# EAGLE design power_board (EAGLE 9.6.2)
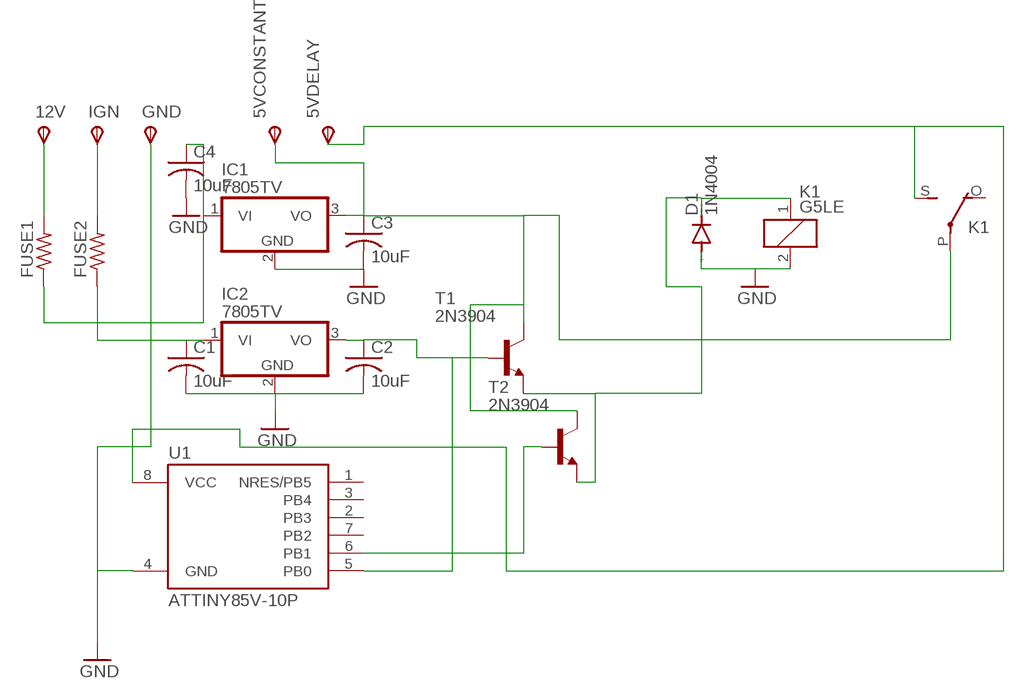
[diagram p0: schematic, sheet 1]

## Parts
5VCONSTANT  TPSPAD1-13Y  [P1-13Y]
5VDELAY  TPSPAD1-13Y  [P1-13Y]
12V  TPSPAD1-13Y  [P1-13Y]
C1  10uF  C-USC0603  [C0603]
C2  10uF  C-USC0603  [C0603]
C3  10uF  C-USC0603  [C0603]
C4  10uF  C-USC0603  [C0603]
D1  1N4004  [DO41-10]
FUSE1  R-US_R0805  [R0805]
FUSE2  R-US_R0805  [R0805]
GND  TPSPAD1-13Y  [P1-13Y]
IC1  7805TV  [TO220V]
IC2  7805TV  [TO220V]
IGN  TPSPAD1-13Y  [P1-13Y]
K1  G5LE  [G5LE]
T1  2N3904  [TO92]
T2  2N3904  [TO92]
U1  ATTINY85V-10P  [PDIP08_300MIL]

## Nets
GND: C1.2 C2.2 C3.2 C4.2 D1.A GND.TP(PP) IC1.2(GND) IC2.2(GND) K1.2 U1.4(GND)
N$1: 12V.TP(PP) FUSE1.2
N$2: FUSE2.2 IGN.TP(PP)
N$3: C1.1 FUSE2.1 IC2.1(VI)
N$4: C4.1 FUSE1.1 IC1.1(VI)
N$5: C2.1 IC2.3(VO) T1.2(B) U1.5(PB0)
N$6: 5VCONSTANT.TP(PP) C3.1 IC1.3(VO) K1.P(2:P) T1.1(C) T2.1(C)
N$7: D1.C K1.1 T1.3(E) T2.3(E)
N$8: 5VDELAY.TP(PP) K1.S(2:S) U1.8(VCC)
N$10: T2.2(B) U1.6(PB1)
Unconnected: K1.O(2:O) U1.1(NRES/PB5) U1.2(PB3) U1.3(PB4) U1.7(PB2)

## Library data of the parts
5VCONSTANT 5VDELAY 12V GND IGN = testpad:TPS: TEST PIN
C1-C4 = rcl:C-US: CAPACITOR, American symbol; SPICEPREFIX: C
D1 = diode:1N4004: DIODE general purpose rectifier, 1 A
FUSE1 FUSE2 = rcl:R-US_: RESISTOR, American symbol; SPICEPREFIX: R
IC1 IC2 = linear:78*: Positive VOLTAGE REGULATOR Source: http://cache.national.com/ds/LM/LM78L05.pdf http://www.fairchildsemi.com/ds/LM/LM7805.pdf
K1 = relay:G5LE: RELAY 1 x switch, 10 A/120 V AC, 8 A/30 V DC, Omron; OC_FARNELL: unknown; OC_NEWARK: unknown
T1 T2 = transistor:2N3904: NPN TRANSISTOR
U1 = _hhn_attiny25_45_85:ATTINY85*: ATMEL ATtiny 85 Packages: P = PDIP 08 30mil S = SOIC 08 EIAJ 208mil Technologies Note: for complete ordering code (temp. range, finish, tape&reel etc.) see www.atmel.com • Supply Voltage: V = (1.8…5.5)V | [blank] = (2.7…5.5)V • Speed: 10 = 10 MHz | 20 = 20 MHz Author: Dipl.-Ing. FH Rainer Bayer HHN Hochschule Heilbronn (Heilbronn University), rainer.bayer@hs-heilbronn.de Ingenieurbüro ing-rb, mail@ing-rb.de

## Board
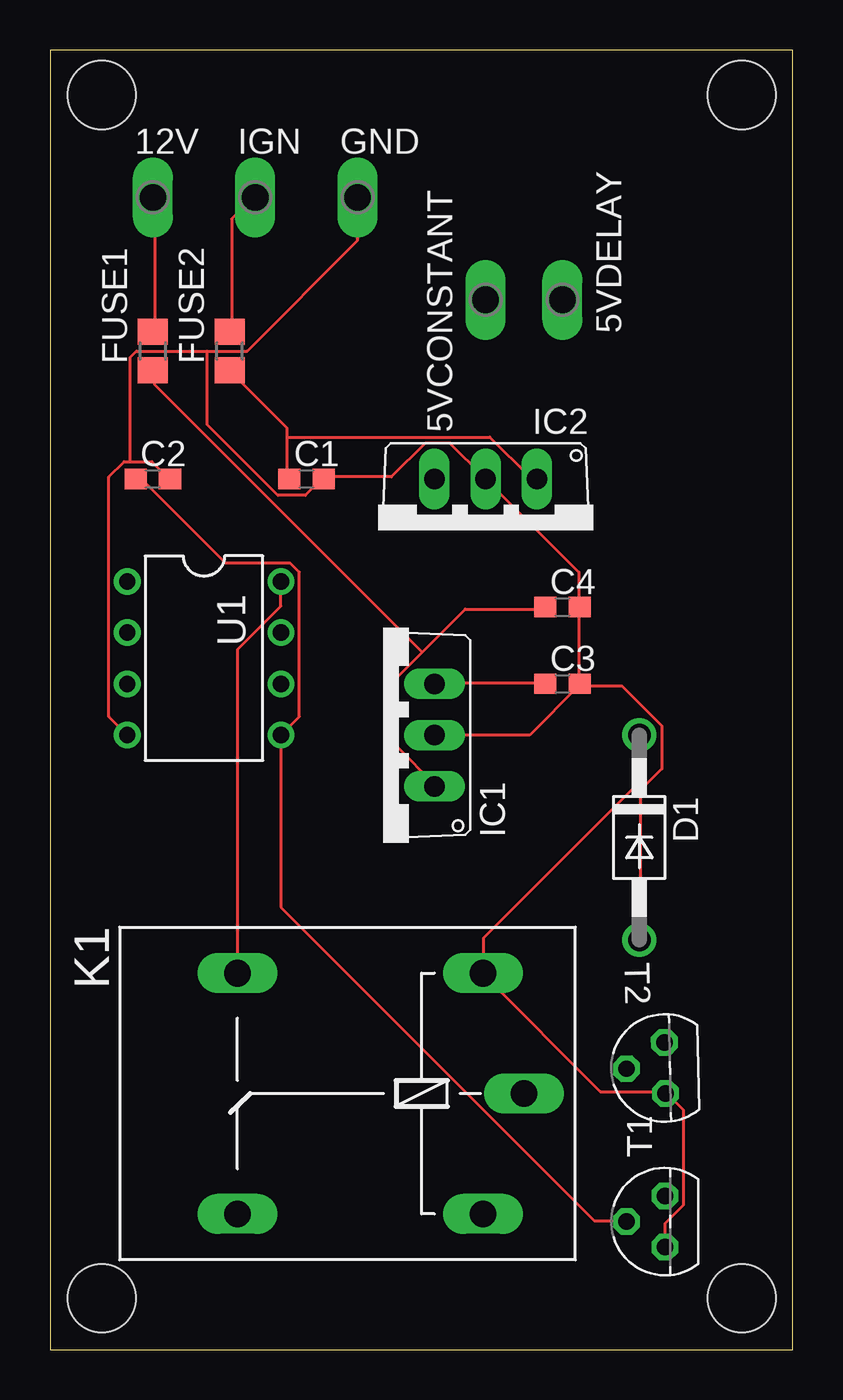
[diagram p1: board, top side]
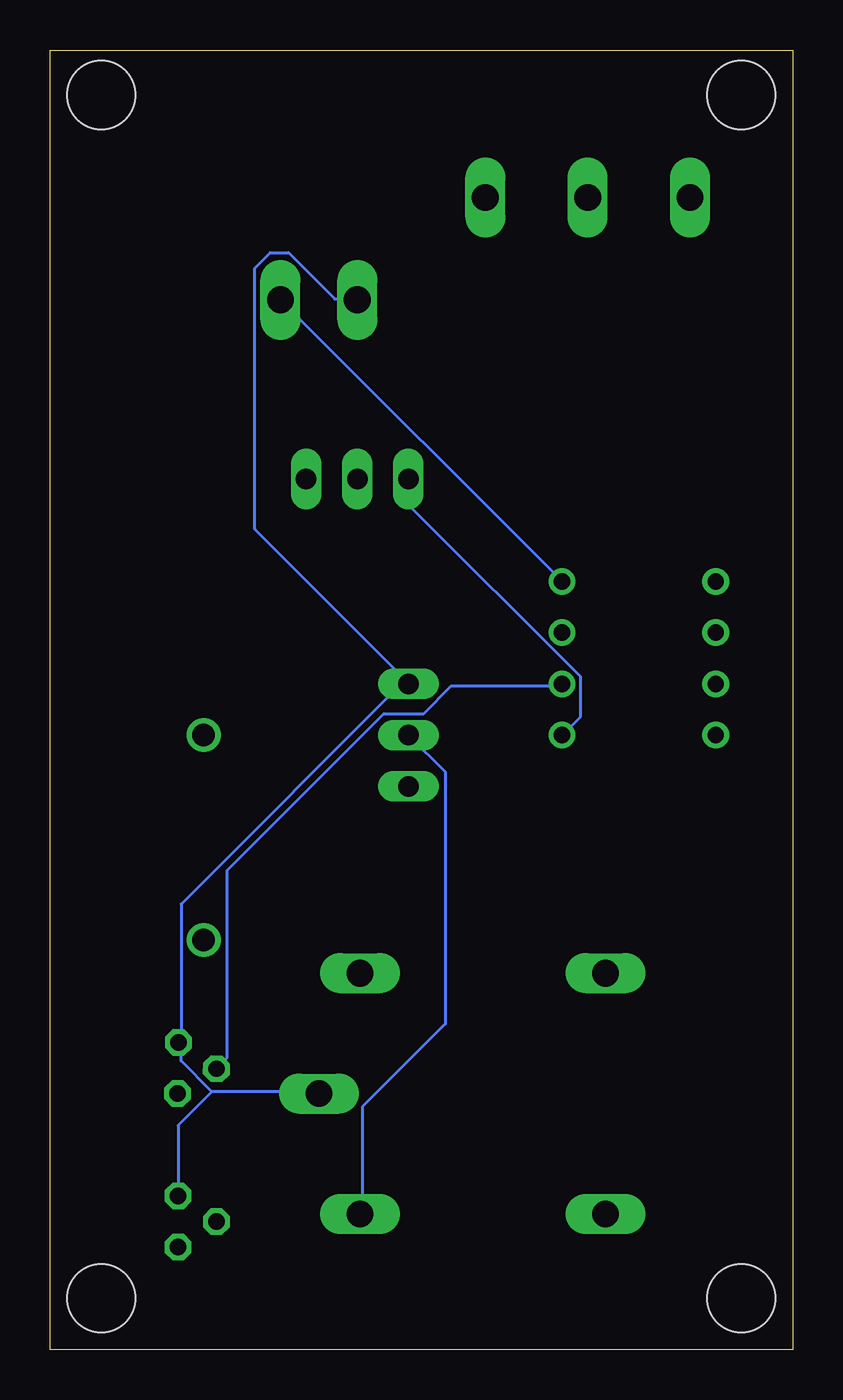
[diagram p2: board, bottom side, seen from below]

Size 36.81 x 64.44 mm. Coordinates in mm from the lower left corner, seen from the top.
Outline: 0,0 36.81,0 36.81,64.44 0,64.44 0,0
Copper layers (1*16): Top 0.035mm / dielectric 1.5mm / Bottom 0.035mm
Design rules "default": minimum track width 6mil, minimum drill 0.35mm, track to track 6mil, track to pad 6mil, pad to pad 6mil, via to via 6mil, smd to smd 6mil, copper to edge 40mil, drill to drill 6mil, minimum pad ring 10mil, minimum via ring 8mil, stop-mask expansion 4mil, vias tented up to drill 0mil, thermal gap 10mil
Holes 3.38 mm at 2.54,62.23 34.29,62.23 2.54,2.54 34.29,2.54

### Footprints (pad centres in the part's own frame; a part is rotated, then mirrored left to right if it is on the bottom)
P1-13Y = drill 1.321 pad 1.905 long: TP 0,0
C0603 = smd 1.1 x 1: 1 -0.85,0; 2 0.85,0
DO41-10 = drill 1.118: A 5.08,0; C -5.08,0
R0805 = smd 1.3 x 1.5: 1 -0.95,0; 2 0.95,0
TO220V = drill 1.016 long: 1 -2.54,-2.54; 2 0,-2.54; 3 2.54,-2.54
G5LE = drill 1.321 long: 1 -7.493,-5.969; 2 -7.493,5.969; O 4.699,5.969; P -9.525,0; S 4.699,-5.969
TO92 = drill 0.813 octagon: 1 1.27,0; 2 0,1.905; 3 -1.27,0
PDIP08_300MIL = drill 0.813: 1 -3.81,-3.81; 2 -1.27,-3.81; 3 1.27,-3.81; 4 3.81,-3.81; 5 3.81,3.81; 6 1.27,3.81; 7 -1.27,3.81; 8 -3.81,3.81

### Placement (x,y rotation side)
5VCONSTANT  21.59,52.07 0 top
5VDELAY  25.4,52.07 0 top
12V  5.08,57.15 0 top
C1  12.7,43.18 0 top
C2  5.08,43.18 0 top
C3  25.4,33.02 0 top
C4  25.4,36.83 0 top
D1  29.21,25.4 270 top
FUSE1  5.08,49.53 90 top
FUSE2  8.89,49.53 90 top
GND  15.24,57.15 0 top
IC1  16.51,30.48 90 top
IC2  21.59,40.64 180 top
IGN  10.16,57.15 0 top
K1  13.97,12.7 180 top
T1  30.48,6.35 90 top
T2  30.48,13.97 91.2 top
U1  7.62,34.29 270 top

### Tracks (layer width: path | path; a pad name or v marks a point on that pad's centre or on a via)
GND
  Top 0.152: 3.96,44.04 3.66,44.04 2.9,43.28 2.9,31.39 U1.4 | 3.96,44.04 5.03,44.04 5.79,43.28 C2.2 | GND.TP 15.24,55.02 9.75,49.53 7.77,49.53 | 7.77,49.53 4.27,49.53 3.96,49.23 3.96,44.04 | C3.2 26.21,33.07 26.21,36.73 C4.2 26.21,36.88 26.21,38.56 21.64,43.13 IC2.2 21.49,43.28 19.81,44.96 18.59,44.96 16.92,43.28 13.56,43.28 C1.2 13.41,43.13 12.65,42.37 11.28,42.37 7.77,45.87 7.77,49.53 | IC1.2 23.77,30.48 26.21,32.92 C3.2 | D1.A 29.26,20.42 29.26,27.74 30.33,28.8 30.33,30.94 28.35,32.92 26.36,32.92 C3.2
  Bottom 0.152: IC1.2 17.22,28.65 17.22,16.15 21.34,12.04 21.34,6.86 K1.2
N$1
  Top 0.152: FUSE1.2 5.18,50.6 5.18,57.15 12V.TP
N$2
  Top 0.152: FUSE2.2 8.99,50.6 8.99,56.08 10.06,57.15 IGN.TP
N$3
  Top 0.152: 11.73,45.26 11.73,45.72 8.99,48.46 FUSE2.1 | 11.73,45.26 11.73,43.28 C1.1 | 11.73,45.26 21.79,45.26 23.77,43.28 24.08,43.28 IC2.1
N$4
  Top 0.152: 18.44,34.59 17.22,33.38 17.22,29.87 19.05,28.04 IC1.1 | 18.44,34.59 20.57,36.73 24.54,36.73 C4.1 | 18.44,34.59 5.18,47.85 5.18,48.46 FUSE1.1
N$5
  Top 0.152: C2.1 4.27,43.13 4.57,43.13 8.69,39.01 11.89,39.01 12.34,38.56 12.34,31.39 U1.5 11.43,21.95 26.98,6.4 28.5,6.4 T1.2
  Bottom 0.152: U1.5 10.52,31.39 10.52,33.38 19.05,41.91 19.05,43.13 IC2.3
N$6
  Top 0.152: C3.1 24.54,33.07 19.05,33.07 IC1.3
  Bottom 0.152: 28.8,12.8 30.33,14.33 30.33,15.09 T2.1 30.33,15.24 30.33,22.1 19.2,33.22 | 28.8,12.8 23.62,12.8 K1.P | T1.1 30.48,11.12 28.8,12.8 | 19.2,33.22 19.05,33.07 IC1.3 19.2,33.22 | 19.2,33.22 26.67,40.69 26.67,53.65 25.91,54.41 24.99,54.41 22.71,52.12 21.64,52.12 5VCONSTANT.TP
N$7
  Top 0.152: T1.3 30.48,5.18 30.48,6.25 31.39,7.16 31.39,11.89 30.63,12.65 T2.3 30.48,12.8 27.28,12.8 21.49,18.59 K1.1 21.49,18.75 21.49,20.42 29.11,28.04 29.11,30.48 D1.C
N$8
  Top 0.152: U1.8 11.43,36.88 9.3,34.75 9.3,18.75 K1.S
  Bottom 0.152: U1.8 25.3,51.97 5VDELAY.TP
N$10
  Bottom 0.152: U1.6 11.43,32.92 16.92,32.92 18.29,31.55 20.27,31.55 28.04,23.77 28.04,14.48 28.5,14.02 T2.2